# EAGLE design Generic Electronics Board (PCB B) (EAGLE 6.4)
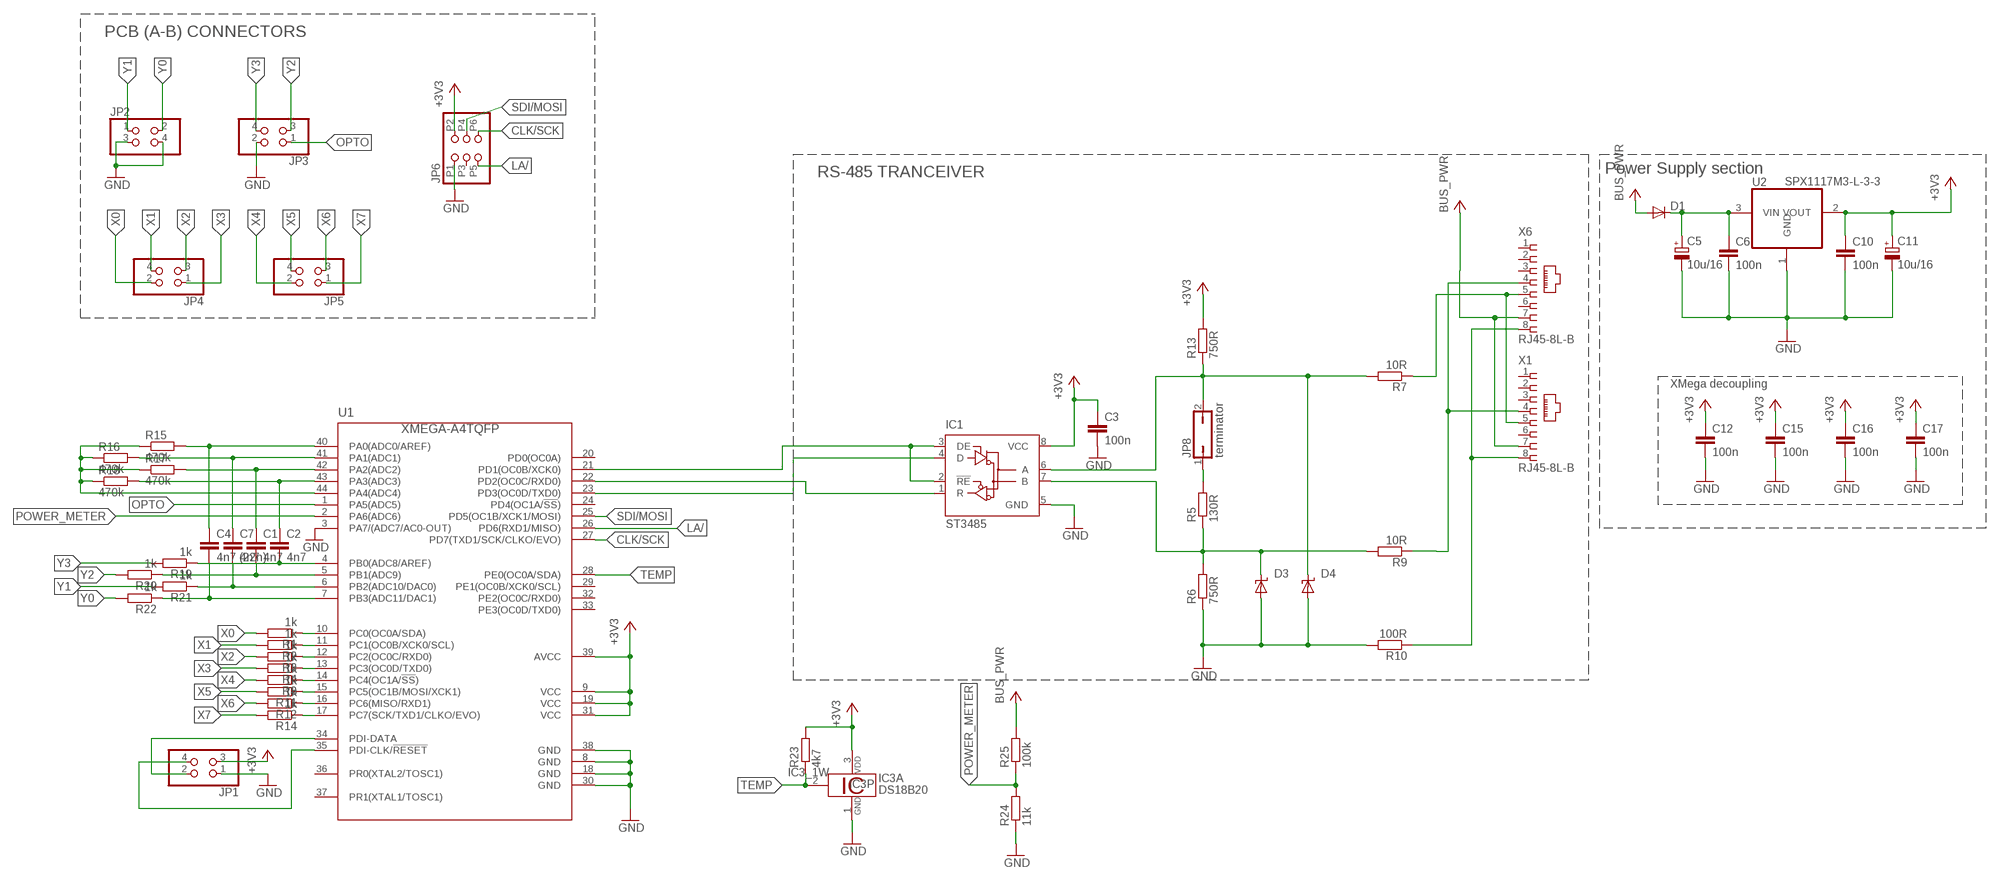
[diagram p0: schematic, sheet 1]

## Parts
C1  4n7  C-EUC0603  [C0603]
C2  4n7  C-EUC0603  [C0603]
C3  100n  C-EUC0603  [C0603]
C4  4n7 (22n)  C-EUC0603  [C0603]
C5  10u/16  CPOL-EUSMCC  [SMC_C]
C6  100n  C-EUC0603  [C0603]
C7  4n7  C-EUC0603  [C0603]
C10  100n  C-EUC0603  [C0603]
C11  10u/16  CPOL-EUSMCC  [SMC_C]
C12  100n  C-EUC0603  [C0603]
C15  100n  C-EUC0603  [C0603]
C16  100n  C-EUC0603  [C0603]
C17  100n  C-EUC0603  [C0603]
D1  DIODE-DO-214AC  [DO-214AC]
D3  SUPPRESSOR-SMBJ  [SMBJ]
D4  SUPPRESSOR-SMBJ  [SMBJ]
IC1  ST3485  75176AD  [D_R-PDSO-G8]
IC3  DS18B20  [TO92-]
JP1  PINHD-2X2SMD  [2X2SMD]
JP2  PINHD-2X2  [2X02]
JP3  PINHD-2X2  [2X02]
JP4  PINHD-2X2  [2X02]
JP5  PINHD-2X2  [2X02]
JP6  PINHD-2X3SMD  [2X3SMD]
JP8  terminator  JP1Q  [JP1]
R1  1k  R-EU_R0603  [R0603]
R2  1k  R-EU_R0603  [R0603]
R3  1k  R-EU_R0603  [R0603]
R4  1k  R-EU_R0603  [R0603]
R5  130R  R-EU_R0603  [R0603]
R6  750R  R-EU_R0603  [R0603]
R7  10R  R-EU_R0603  [R0603]
R8  1k  R-EU_R0603  [R0603]
R9  10R  R-EU_R0603  [R0603]
R10  100R  R-EU_R0603  [R0603]
R11  1k  R-EU_R0603  [R0603]
R12  1k  R-EU_R0603  [R0603]
R13  750R  R-EU_R0603  [R0603]
R14  1k  R-EU_R0603  [R0603]
R15  470k  R-EU_R0603  [R0603]
R16  470k  R-EU_R0603  [R0603]
R17  470k  R-EU_R0603  [R0603]
R18  470k  R-EU_R0603  [R0603]
R19  1k  R-EU_R0603  [R0603]
R20  1k  R-EU_R0603  [R0603]
R21  1k  R-EU_R0603  [R0603]
R22  1k  R-EU_R0603  [R0603]
R23  4k7  R-EU_R0603  [R0603]
R24  11k  R-EU_R0603  [R0603]
R25  100k  R-EU_R0603  [R0603]
U1  XMEGA-A4TQFP  [TQFP44]
U2  SPX1117M3-L-3-3  REG1117  [SOT223]
X1  RJ45-8L-B  [RJ45-NO-SHIELD]
X6  RJ45-8L-B  [RJ45-NO-SHIELD]

## Nets
+3V3: C3.1 C10.1 C11.+ C12.1 C15.1 C16.1 C17.1 IC1.8(VCC) IC3.3 JP1.3 JP6.P2 R13.2 R23.2 U1.9(VCC) U1.19(VCC) U1.31(VCC) U1.39(AVCC) U2.2(VOUT)
+12V: C5.+ C6.1 D1.C U2.3(VIN)
BUS_PWR: D1.A R25.2 X1.7 X6.7
CLK/SCK: JP6.P6 U1.27(PD7(TXD1/SCK/CLKO/EVO))
GND: C3.2 C5.- C6.2 C10.2 C11.- C12.2 C15.2 C16.2 C17.2 D3.A D4.A IC1.5(GND) IC3.1 JP1.1 JP2.3 JP2.4 JP3.2 JP6.P1 R6.1 R10.2 R24.1 U1.3(PA7/(ADC7/AC0-OUT)) U1.8(GND) U1.18(GND) U1.30(GND) U1.38(GND) U2.1(GND)
GND_RS485: R10.1 X1.8 X6.8
LA/: JP6.P5 U1.26(PD6(RXD1/MISO))
N$1: R1.1 U1.10(PC0(OC0A/SDA))
N$2: R2.1 U1.11(PC1(OC0B/XCK0/SCL))
N$4: IC1.1(R) U1.22(PD2(OC0C/RXD0))
N$5: IC1.4(D) U1.23(PD3(OC0D/TXD0))
N$6: IC1.2(!RE) IC1.3(DE) U1.21(PD1(OC0B/XCK0))
N$10: R8.1 U1.14(PC4(OC1A/!SS!))
N$11: R11.1 U1.15(PC5(OC1B/MOSI/XCK1))
N$12: R12.1 U1.16(PC6(MISO/RXD1))
N$13: R14.1 U1.17(PC7(SCK/TXD1/CLKO/EVO))
N$14: D3.C IC1.7(B) R5.1 R6.2 R9.2
N$15: JP8.1 R5.2
N$17: C2.1 R18.2 U1.43(PA3(ADC3))
N$18: C2.2 R19.1 U1.4(PB0(ADC8/AREF))
N$19: C1.2 R20.1 U1.5(PB1(ADC9))
N$20: C1.1 R17.2 U1.42(PA2(ADC2))
N$21: C7.2 R21.1 U1.6(PB2(ADC10/DAC0))
N$22: C4.2 R22.1 U1.7(PB3(ADC11/DAC1))
N$23: C7.1 R16.2 U1.41(PA1(ADC1))
N$24: C4.1 R15.2 U1.40(PA0(ADC0/AREF))
N$25: R15.1 R16.1 R17.1 R18.1 U1.44(PA4(ADC4))
OPTO: JP3.1 U1.1(PA5(ADC5))
PC2: R3.1 U1.12(PC2(OC0C/RXD0))
PC3: R4.1 U1.13(PC3(OC0D/TXD0))
PDI_CLK: JP1.4 U1.35(PDI-CLK/!RESET)
PDI_DATA: JP1.2 U1.34(PDI-DATA)
POWER_METER: R24.2 R25.1 U1.2(PA6(ADC6))
RS485_A: R7.1 X1.5 X6.5
RS485_A2: D4.C IC1.6(A) JP8.2 R7.2 R13.1
RS485_B: R9.1 X1.4 X6.4
SDI/MOSI: JP6.P4 U1.25(PD5(OC1B/XCK1/MOSI))
TEMP: IC3.2 R23.1 U1.28(PE0(OC0A/SDA))
X0: JP4.2 R1.2
X1: JP4.4 R2.2
X2: JP4.3 R3.2
X3: JP4.1 R4.2
X4: JP5.2 R8.2
X5: JP5.4 R11.2
X6: JP5.3 R12.2
X7: JP5.1 R14.2
Y0: JP2.2 R22.2
Y1: JP2.1 R21.2
Y2: JP3.3 R20.2
Y3: JP3.4 R19.2
Unconnected: JP6.P3 U1.20(PD0(OC0A)) U1.24(PD4(OC1A/!SS!)) U1.29(PE1(OC0B/XCK0/SCL)) U1.32(PE2(OC0C/RXD0)) U1.33(PE3(OC0D/TXD0)) U1.36(PR0(XTAL2/TOSC1)) U1.37(PR1(XTAL1/TOSC1)) X1.1 X1.2 X1.3 X1.6 X6.1 X6.2 X6.3 X6.6

## Notes on the sheet
- PCB (A-B) CONNECTORS
- RS-485 TRANCEIVER | Power Supply section
- XMega decoupling

## Library data of the parts
C1-C4 C6 C7 C10 C12 C15-C17 = rcl:C-EU: CAPACITOR, European symbol
C5 C11 = rcl:CPOL-EU: POLARIZED CAPACITOR, European symbol
D1 = diode:DIODE-: DIODE
D3 D4 = diode:SUPPRESSOR-: Suppressor diode
IC1 = 751xx:75176A: DIFFERENTIAL BUS TRANSCEIVER Source: http://focus.ti.com/lit/ds/symlink/sn75176a.pdf
IC3 = 1wire:DS18B20: Programmable Resolution Digital Thermometer This chip provides a onewire thermosensor with approx. 0.5°C accuracy. A programmable over/undertemperure alarm is available. The precision can be set from 9..12 bits. Notes: Vdd must be applied for accurate measurements at low temperatures, as the parasite power circuit otherwise heats the sensor. If parasite power is used, Vdd has to be connected to GND. The DS1822 is a low-cost thermometer chip, the DS18S20 is similar to the DS18B20, but with 9 Bit precision only. Author: Jan Kandziora <jjj@gmx.de>
JP1-JP5 = pinhead:PINHD-2X2: PIN HEADER
JP6 = pinhead:PINHD-2X3: PIN HEADER
JP8 = jumper:JP1Q: JUMPER
R1-R25 = rcl:R-EU_: RESISTOR, European symbol
U1 = avr-7:XMEGA-A4: Atmel XMega A4 series processor
U2 = burr-brown:REG1117: 800mA and 1A Low Dropout (LDO) Positive Regulator 1.8V, 2.5V, 2.85V, 3.3V, 5V, and Adj; MPN: REG1117; OC_FARNELL: 1097566; OC_NEWARK: 14P6981
X1 X6 = con-tycoelectronics:RJ45: CORCOM Modular RJ Jacks No Shield Source: www.tycoelectronics.com .. ENG_DS_1654001_1099_RJ_L_0507.pdf; MF: TYCO ELECTRONICS; MPN: RJ45-8L-B; OC_FARNELL: 1279843; OC_NEWARK: 52K4445

## Board
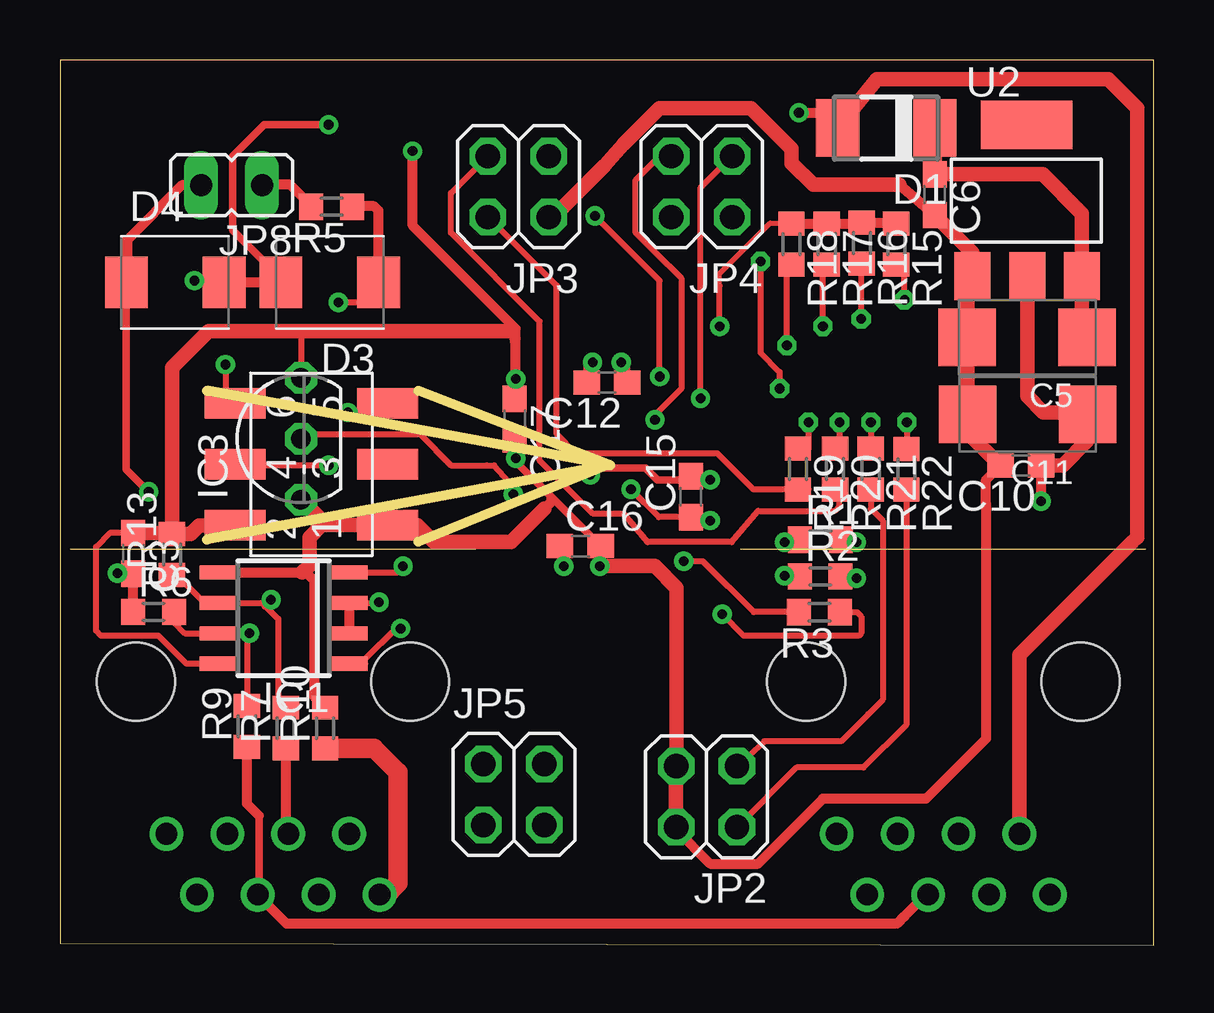
[diagram p1: board, top side]
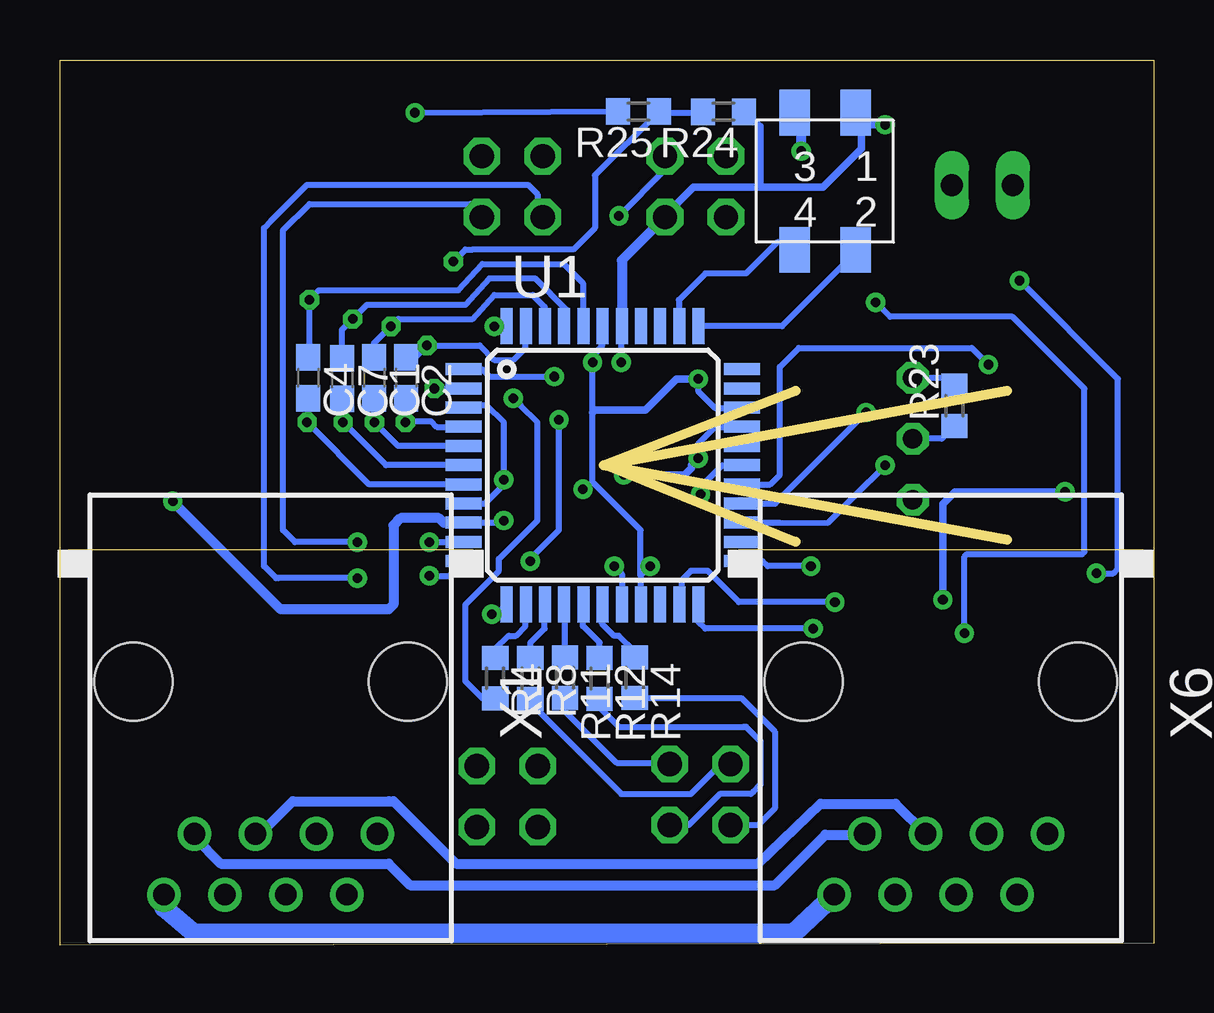
[diagram p2: board, bottom side, seen from below]

Size 45.6 x 36.9 mm. Coordinates in mm from the lower left corner, seen from the top.
Outline: 0,0.07 45.6,0 45.6,36.9 0,36.9 0,0.07
Copper layers (1*16): Top 0.035mm / dielectric 1.5mm / Bottom 0.035mm
Design rules "default": minimum track width 10mil, minimum drill 24mil, track to track 8mil, track to pad 8mil, pad to pad 8mil, via to via 8mil, smd to smd 8mil, copper to edge 40mil, drill to drill 8mil, minimum pad ring 10mil, minimum via ring 8mil, stop-mask expansion 4mil, vias tented up to drill 0mil, thermal gap 10mil
bRestrict: area 26.8,1.7 to 30,11.1; area 15.4,27.4 to 19.2,36.5
Milling: 4 lines

### Footprints (pad centres in the part's own frame; a part is rotated, then mirrored left to right if it is on the bottom)
C0603 = smd 1.1 x 1: 1 -0.85,0; 2 0.85,0
SMC_C = smd 2.4 x 2.4: + -2.5,0; - 2.5,0
DO-214AC = smd 1.8 x 2.4: A 2.025,0; C -2.025,0
SMBJ = smd 1.78 x 2.16: A 2.04,0; C -2.03,0
D_R-PDSO-G8 = smd 0.6 x 1.5: 1 -1.905,-2.75; 2 -0.635,-2.75; 3 0.635,-2.75; 4 1.905,-2.75; 5 1.905,2.75; 6 0.635,2.75; 7 -0.635,2.75; 8 -1.905,2.75
TO92- = drill 0.813 octagon: 1 -2.54,0; 2 0,0; 3 2.54,0
2X2SMD = smd 0.635 x 1.27: 1 -0.635,-2.54; 2 -0.635,2.54; 3 1.905,-2.54; 4 1.905,2.54; P$1 0,2.54; P$2 2.54,2.54; P$4 0,-2.54; P$5 2.54,-2.54; P$9 2.54,3.175; P$10 1.905,3.175; P$11 0,3.175; P$12 -0.635,3.175; P$13 -0.635,-3.175; P$14 0,-3.175; P$15 1.905,-3.175; P$16 2.54,-3.175
2X02 = drill 1.016 octagon: 1 -1.27,-1.27; 2 -1.27,1.27; 3 1.27,-1.27; 4 1.27,1.27
2X3SMD = smd 1.27 x 2.54: P1 -3.175,-3.175; P2 -3.175,3.175; P3 -0.635,-3.175; P4 -0.635,3.175; P5 1.905,-3.175; P6 1.905,3.175
JP1 = drill 0.914 long: 1 0,-1.27; 2 0,1.27
R0603 = smd 1 x 1.1: 1 -0.85,0; 2 0.85,0
TQFP44 = smd 1.5 x 0.5: 1 -5.8,4; 2 -5.8,3.2; 3 -5.8,2.4; 4 -5.8,1.6; 5 -5.8,0.8; 6 -5.8,0; 7 -5.8,-0.8; 8 -5.8,-1.6; 9 -5.8,-2.4; 10 -5.8,-3.2; 11 -5.8,-4; 23 5.8,-4; 24 5.8,-3.2; 25 5.8,-2.4; 26 5.8,-1.6; 27 5.8,-0.8; 28 5.8,0; 29 5.8,0.8; 30 5.8,1.6; 31 5.8,2.4; 32 5.8,3.2; 33 5.8,4 | smd 0.5 x 1.5: 12 -4,-5.8; 13 -3.2,-5.8; 14 -2.4,-5.8; 15 -1.6,-5.8; 16 -0.8,-5.8; 17 0,-5.8; 18 0.8,-5.8; 19 1.6,-5.8; 20 2.4,-5.8; 21 3.2,-5.8; 22 4,-5.8; 34 4,5.8; 35 3.2,5.8; 36 2.4,5.8; 37 1.6,5.8; 38 0.8,5.8; 39 0,5.8; 40 -0.8,5.8; 41 -1.6,5.8; 42 -2.4,5.8; 43 -3.2,5.8; 44 -4,5.8
SOT223 = smd 1.499 x 2.007: 1 -2.261,-3.15; 2 0.025,-3.15; 3 2.311,-3.15 | smd 3.81 x 2.007: 4 0,3.15
RJ45-NO-SHIELD = drill 0.9 pad 1.4: 1 -4.445,6.35; 2 -3.175,8.89; 3 -1.905,6.35; 4 -0.635,8.89; 5 0.635,6.35; 6 1.905,8.89; 7 3.175,6.35; 8 4.445,8.89 | hole 3.251: -5.715,0; 5.715,0

### Placement (x,y rotation side)
C1  32.51,23.65 270 bottom
C2  31.17,23.65 270 bottom
C3  3.06,16.33 270 top
C4  35.26,23.65 270 bottom
C5  40.32,25.34 180 top
C6  36.46,31.28 270 top
C7  33.84,23.62 270 bottom
C10  40.05,20 180 top
C11  40.33,22.13 180 top
C12  22.8,23.46 180 top
C15  26.3,18.69 90 top
C16  21.69,16.63 0 top
C17  18.95,21.93 270 top
D1  34.44,34.06 180 top
D3  11.25,27.63 180 top
D4  4.8,27.63 0 top
IC1  9.32,13.63 90 top
IC3  10.05,21.11 90 top
JP1  12.76,31.84 180 bottom
JP2  26.95,6.19 180 top
JP3  19.11,31.62 180 top
JP4  26.75,31.62 180 top
JP5  18.92,6.28 0 top
JP6  10.48,20.68 90 top
JP8  7.15,31.68 90 top
R1  31.7,16.9 0 top
R2  31.69,15.37 0 top
R3  31.66,13.88 180 top
R4  27.46,11.13 270 bottom
R5  11.32,30.78 180 top
R6  3.9,13.89 0 top
R7  9.41,9.05 90 top
R8  25.99,11.12 270 bottom
R9  7.79,9.12 90 top
R10  11.05,9.05 90 top
R11  24.55,11.15 270 bottom
R12  23.11,11.12 270 bottom
R13  4.67,16.29 90 top
R14  21.64,11.15 270 bottom
R15  34.86,29.22 270 top
R16  33.42,29.26 270 top
R17  31.96,29.22 270 top
R18  30.49,29.22 270 top
R19  30.76,19.85 270 top
R20  32.31,19.85 270 top
R21  33.79,19.85 270 top
R22  35.28,19.84 270 top
R23  8.32,22.48 90 bottom
R24  17.94,34.74 180 bottom
R25  21.49,34.75 180 bottom
U1  22.98,20.01 0 bottom
U2  40.29,31.04 0 top
X1  36.82,10.99 180 bottom
X6  8.88,10.99 180 bottom

### Tracks (layer width: path | path; a pad name or v marks a point on that pad's centre or on a via)
+3V3  (via drill 0.4)
  Top 0.254: C12.1 23.65,24.05 v23.4,24.3 | C16.1 20.84,15.96 v21,15.8 | v27.1,17.7 26.44,17.7 C15.1 24.96,17.84 v23.8,19 | C17.1 18.95,23.55 v19,23.6 | 18.8,25.6 18.9,24.9 | 18.8,25.6 18.6,25.6 18.8,25.6 | 18.8,25.6 19,25.3 | IC1.8 5.27,11.73 4.2,12.8 4.1,12.9 1.7,12.9 1.5,13.1 1.5,16.6 2.1,17.2 3.04,17.2 C3.1 | 6.2,25.6 10.1,25.6 10.05,25.55 IC3.3
  Top 0.406: v40.9,18.5 C10.1 | v19,23.6 19,25.3 19,25.7 14.7,30 v14.7,33.1
  Top 0.61: U2.2 40.32,22.88 41,22.2 42.76,22.2 C11.+ 42.83,21.03 41.8,20 C10.1 | C3.1 4.63,17.18 R13.2 | R13.2 5.44,17.14 5.8,17.5 JP6.P2 | R13.2 4.67,24.07 6.2,25.6 10.1,25.6 18.6,25.6 18.8,25.6
  Bottom 0.254: U1.39 23,25.79 23,25 23.4,24.5 v23.4,24.3 23.4,22.2 23.4,19.3 | v21,15.8 21.4,15.4 | 21.4,15.4 21.4,14.1 21.38,14.12 U1.19 | v27.1,17.7 27.2,17.6 28.8,17.6 | 21.4,15.4 21.4,17.3 23.4,19.3 | v23.8,19 23.7,19 23.4,19.3 | v19,23.6 19,23.1 18.3,22.4 17.2,22.4 U1.31 | R23.2 8.64,23.65 IC3.3
  Bottom 0.305: v19,23.6 19.9,23.6 21.2,22.3 23.3,22.3 23.4,22.2
  Bottom 0.406: v40.9,18.5 36.4,14 31.9,14 31.7,14.2 31.7,17.5 31.4,17.8 29.8,17.8 29.6,17.6 28.8,17.6 U1.9 | v14.7,33.1 14.7,33.98 | 14.7,33.98 14.7,34.4 | 14.7,34.4 14.7,34.5 14.7,34.4 | JP1.3 14.66,34.02 14.7,33.98
+12V
  Top 0.61: D1.C 36.46,34.45 C6.1 40.97,32.13 42.6,30.5 42.6,28.09 U2.3 42.6,25.56 C5.+
BUS_PWR  (via drill 0.4)
  Top 0.406: v30.8,34.7 32.41,34.7 D1.A
  Top 0.61: X1.7 39.99,12.09 44.7,16.8 44.9,17 44.9,34.9 43.7,36.1 34.05,36.1 D1.A
  Bottom 0.254: R25.2 v30.8,34.69
  Bottom 0.406: X1.7 39.99,4.5 38.9,3.4 31.9,3.4 31,2.5 15.8,2.5 13.7,4.6 12.09,4.6 X6.7 | v30.8,34.69 v30.8,34.7
CLK/SCK  (via drill 0.4)
  Top 0.254: JP6.P6 7.32,22.7 7.4,22.7 7.4,22.6 6.9,23.1 v6.9,24.2
  Bottom 0.254: U1.27 15.99,19.21 15.6,19.6 15.6,24.1 14.8,24.9 7.6,24.9 7.1,24.4 v6.9,24.2
GND  (via drill 0.4)
  Top 0.254: C12.2 21.95,24.15 v22.2,24.3 | C16.2 22.5,16.59 v22.5,15.8 | C15.2 26.44,19.4 v27.1,19.4 | C17.2 18.95,20.35 v19,20.3 | 10.1,15.54 10.27,15.54 | 20.4,18.4 20.4,18.7 20.43,18.73 | C3.2 2.53,15.47 v2.4,15.5 | v5.6,27.7 6.77,27.7 D4.A | 10.91,17.72 10.91,17.51
  Top 0.305: v19,20.3 19,20.17 20.43,18.73 C16.2 | 26.44,19.4 24.9,19.4 24.4,19.9 22.4,19.9 v22.1,19.6 | D3.A 9.21,27.79 7.2,29.8 7.2,32.9 8.5,34.2 v11.2,34.2
  Top 0.406: JP2.4 25.7,4.9 25.7,4.8 27.1,3.4 29.1,3.4 29.9,4.2 31.8,6.1 36.1,6.1 36.5,6.5 38.6,8.6 38.6,18.4 38.6,19.4 C10.2 | D4.A D3.A | 34.99,31.7 C6.2 | R6.1 C3.2 | IC1.5 10.1,15.54 | 10.27,15.54 10.6,15.2 10.6,10.35 R10.2 | 20.2,18.2 20.4,18.4 20.5,18.5
  Top 0.61: C10.2 37.83,21.37 C11.- C5.- 37.82,27.88 U2.1 38.03,28.86 C6.2 | JP2.4 25.68,7.31 | 25.68,7.31 JP2.3 | JP2.3 25.68,7.48 25.7,7.5 25.7,14.9 24.8,15.8 v22.5,15.8 | JP2.3 25.68,7.31 | JP3.2 20.55,30.35 22.7,32.5 23.5,33.4 25,34.9 28.8,34.9 30.5,33.2 30.5,32.6 31.4,31.7 34.99,31.7 | 20.2,18.2 18.8,16.8 15.6,16.8 14.89,17.51 JP6.P1 10.91,17.51 10.4,17 10.4,15.84 10.1,15.54 | IC3.1 10.91,17.72
  Bottom 0.254: v22.2,24.3 22.2,25.79 U1.38 | v22.5,15.8 22.18,15.48 U1.18 | 28.8,18.4 27.9,18.4 27.1,19.2 v27.1,19.4 27.1,21.8 27.8,22.5 28.69,22.5 U1.3 | v19,20.3 19,20.9 18.3,21.6 U1.30 | v2.4,15.5 1.7,15.5 1.5,15.7 1.5,23.6 v5.6,27.7 | R24.1 16.4,34.15 16.4,31.6
  Bottom 0.305: v22.1,19.6 19.57,19.6 19.29,19.88 19.29,20.02 v19,20.3 | v11.2,34.2 11.95,34.2 JP1.1 12.2,34.45 12.2,34.5 | JP3.2 20.38,30.42 19.3,31.5 19.2,31.6 16.4,31.6 13.8,31.6 12.2,33.2 12.2,34.5 | 12.2,34.5 12.3,34.5 12.82,33.98
  Bottom 0.406: 28.8,18.4 U1.8 | JP3.2 22.18,28.55 U1.38
GND_RS485
  Top 0.254: 13.5,2 13.42,2 X6.8
  Top 0.813: R10.1 13.1,8.2 14.1,7.2 14.1,2.6 13.5,2
  Bottom 0.813: X1.8 41.26,1.57 40,0.5 15.02,0.5 X6.8
LA/  (via drill 0.4)
  Top 0.254: v12,22.2 13.27,22.2 JP6.P5
  Bottom 0.254: U1.26 15.79,18.41 v12,22.2
N$1  (via drill 0.4)
  Top 0.254: R1.1 v30.2,16.8
  Bottom 0.254: v30.2,16.8 U1.10
N$2  (via drill 0.4)
  Top 0.254: R2.1 30.23,15.37 v30.2,15.4
  Bottom 0.254: v30.2,15.4 29.39,15.4 U1.11
N$4  (via drill 0.4)
  Top 0.254: IC1.1 12.73,11.73 12.73,11.93 14,13.2 v14.2,13.2
  Bottom 0.254: v14.2,13.2 18.7,13.2 19,13.5 19,14.19 U1.22
N$5  (via drill 0.4)
  Top 0.254: IC1.4 14.03,15.54 v14.3,15.8
  Bottom 0.254: v14.3,15.8 16.1,15.8 16.3,16 U1.23
N$6  (via drill 0.4)
  Top 0.254: IC1.3 13.27,14.27 v13.3,14.3
  Top 0.406: IC1.2 IC1.3
  Bottom 0.254: v13.3,14.3 17.3,14.3 18.6,15.6 19.3,15.6 19.7,15.2 19.7,14.3 19.8,14.2 U1.21
N$10
  Bottom 0.254: R8.1 25.99,12.61 25.4,13.2 25.4,14.19 U1.14
N$11
  Bottom 0.254: R11.1 24.55,14.18 U1.15
N$12
  Bottom 0.254: R12.1 23.11,12.61 23.8,13.3 23.8,14.19 U1.16
N$13
  Bottom 0.254: R14.1 21.64,12.24 22.3,12.9 22.5,12.9 23,13.4 23,14.3 23,14.23 U1.17
N$14  (via drill 0.4)
  Top 0.254: R6.2 4.75,13.45 5.2,13 IC1.7 | IC1.7 7.5,13 7.8,12.7 R9.2 | IC1.7 7.7,13 v7.9,13 | v11.6,26.8 12.5,26.8 13.3,27.6 D3.C
  Top 0.406: D3.C 13.28,30.62 13.1,30.8 12.19,30.8 R5.1
  Bottom 0.254: v7.9,13 7.9,16.2 7.8,16.3 3,16.3 2.9,16.4 2.9,23.2 5.9,26.2 11,26.2 v11.6,26.8
N$15
  Top 0.406: R5.2 10.47,30.83 9.6,31.7 8.44,31.7 JP8.1
N$17  (via drill 0.4)
  Top 0.254: v30.3,25 30.3,28.56 R18.2
  Bottom 0.254: C2.1 30.8,24.5 v30.3,25 28.1,25 27.5,24.4 26.7,24.4 26.2,24.9 26.2,25.79 U1.43
N$18  (via drill 0.4)
  Top 0.254: v31.2,21.8 31.2,20.7 R19.1
  Bottom 0.254: C2.2 31.16,21.84 | 31.16,21.84 v31.2,21.8 | 31.16,21.84 30.14,21.84 29.9,21.6 U1.4
N$19  (via drill 0.4)
  Top 0.254: v32.5,21.8 32.5,20.71 R20.1
  Bottom 0.254: C1.2 v32.51,21.81 v32.5,21.8 31.51,20.81 U1.5
N$20  (via drill 0.4)
  Top 0.254: v31.8,25.8 31.8,28.53 R17.2
  Bottom 0.254: C1.1 32.51,25.09 v31.8,25.8 31.5,26.1 28.4,26.1 27.5,27.1 25.9,27.1 25.4,26.6 25.4,25.83 U1.42
N$21  (via drill 0.4)
  Top 0.254: v33.8,21.8 R21.1
  Bottom 0.254: C7.2 33.84,21.84 v33.8,21.8 32.01,20.01 U1.6
N$22  (via drill 0.4)
  Top 0.254: v35.3,21.8 35.3,20.71 R22.1
  Bottom 0.254: C4.2 35.26,21.84 v35.3,21.8 32.71,19.21 U1.7
N$23  (via drill 0.4)
  Top 0.254: v33.4,26.1 33.4,28.43 R16.2
  Bottom 0.254: C7.1 33.84,25.66 v33.4,26.1 32.8,26.7 28.7,26.7 27.7,27.8 25.8,27.8 24.5,26.5 24.5,25.89 U1.41
N$24  (via drill 0.4)
  Top 0.254: v35.2,26.9 35.2,28.23 R15.2
  Bottom 0.254: C4.1 35.2,24.5 v35.2,26.9 34.8,27.3 29,27.3 28,28.4 24.6,28.4 23.8,27.6 23.8,25.83 U1.40
N$25  (via drill 0.4)
  Top 0.203: 27.5,27.48 27.5,28 29.6,30.1 30.22,30.1 R18.1
  Top 0.254: v27.5,25.8 27.5,27.48
  Top 0.406: R18.1 31.93,30.07 | 31.93,30.07 32,30 | R15.1 34.82,30.11 R16.1 33.38,30.07 R17.1 31.93,30.07
  Bottom 0.254: U1.44 v27.49,25.81 v27.5,25.8
OPTO  (via drill 0.4)
  Top 0.254: v25,23.7 25,27.7 v22.3,30.4
  Bottom 0.254: U1.1 28.01,24.01 27.7,23.7 v25,23.7 | v22.3,30.4 20.4,32.3 20.4,32.8 20.38,32.82 JP3.1
PC2  (via drill 0.4)
  Top 0.254: R3.1 33.22,13.88 33.4,13.7 33.4,13 33.3,12.9 28.5,12.9 v27.6,13.8
  Bottom 0.254: v27.6,13.8 27.39,13.8 U1.12
PC3
  Bottom 0.254: R4.1 27.46,12.34 26.9,12.9 26.6,12.9 26.2,13.3 26.2,14.2 U1.13
PDI_CLK
  Bottom 0.254: JP1.4 15.7,29.3 17,28 18.7,28 19.8,26.9 19.8,25.83 U1.35
PDI_DATA
  Bottom 0.254: JP1.2 12.12,29.18 15.5,25.8 U1.34
POWER_METER  (via drill 0.4)
  Top 0.254: v29.2,28.5 29.2,24.7 30,23.9 v30,23.2
  Bottom 0.254: R24.2 18.8,34.8 18.8,34.7 20.59,34.7 R25.1 23.3,32.09 23.3,29.9 24.2,29 24.3,29 24.4,29 28.4,29 28.7,29 v29.2,28.5 | v30,23.2 29.6,23.2 29.5,23.2 28.8,23.2 U1.2
RS485_A
  Top 0.406: R7.1 9.41,4.75 X6.5
  Bottom 0.406: X1.5 37.26,4.64 35.9,6 31.9,6 31.7,6 29.1,3.4 16.5,3.4 13.9,5.9 10.77,5.9 X6.5
RS485_A2  (via drill 0.4)
  Top 0.254: R7.2 9.1,10.21 9.1,13.6 8.55,14.15 8.43,14.27 IC1.6 6.03,14.27 5.2,15.1 5.01,15.1 R13.1
  Top 0.305: D4.C 2.77,19.83 v3.7,18.9 | v8.8,14.4 8.55,14.15
  Top 0.406: JP8.2 5.08,31.68 2.8,29.4 2.8,27.66 D4.C
  Bottom 0.305: v3.7,18.9 8.3,18.9 8.8,18.4 v8.8,14.4
RS485_B
  Top 0.305: 8.3,5.4 8.3,2.16 X6.4 | X1.4 36.1,2.1
  Top 0.406: 36.1,2.1 35.2,1.2 34.9,0.9 9.45,0.9 X6.4 | R9.1 7.79,5.91 8.3,5.4
SDI/MOSI  (via drill 0.4)
  Top 0.254: 7.35,20 JP6.P4 7.35,20 | v11.2,20 7.35,20
  Bottom 0.254: U1.25 15.59,17.61 13.6,17.6 12.5,18.7 v11.2,20
TEMP  (via drill 0.4)
  Top 0.254: IC3.2 10.24,21.3 15,21.3 16.3,20 17.8,20 18.1,20 18.9,19.1 v18.9,18.8
  Bottom 0.254: R23.1 8.84,21.11 IC3.2 | U1.28 17.2,20 18,20 18.9,19.1 v18.9,18.8
X0  (via drill 0.4)
  Top 0.254: R1.2 v33.2,16.8
  Bottom 0.254: v33.2,16.8 35.8,16.8 36.3,17.3 36.3,29.8 35.2,30.9 28.5,30.9 28,30.4 | 28,30.4 28.1,30.4 | 28.1,30.4 28,30.4 | 28,30.4 28.1,30.4 | 28.1,30.4 28.07,30.4 JP4.2
X1  (via drill 0.4)
  Top 0.254: R2.2 v33.2,15.3
  Bottom 0.254: v33.2,15.3 36.5,15.3 36.6,15.3 37.1,15.8 37.1,16.1 | JP4.4 25.7,30.57 25.7,31.3 26.1,31.7 35.3,31.7 36.8,30.2 37.1,29.9 37.1,16.1 | 37.1,16 37.1,16.1
X2  (via drill 0.4)
  Top 0.254: R3.2 28.92,13.88 26.8,16 v26,16 | JP4.3 25.5,32.9 25,32.9 24,31.9 24,29.7 24.8,28.9 25.9,27.8 25.9,23.2 24.8,22.1 v24.8,21.9
  Bottom 0.254: v26,16 26,16.1 24.8,17.3 v24.8,21.9
X3  (via drill 0.4)
  Top 0.254: v26.7,22.8 26.7,31.57 JP4.1
  Bottom 0.254: R4.2 27.98,10.28 28.7,11 28.7,14.2 27.3,15.6 27.3,16.1 25.7,17.7 25.7,21.8 26.4,22.5 26.6,22.7 v26.7,22.8
X4
  Bottom 0.254: R8.2 25.99,10.09 22.2,6.3 19.3,6.3 18.2,7.4 18.1,7.5 17.7,7.5 JP5.2
X5
  Bottom 0.254: R11.2 24.55,9.75 22.4,7.6 20.24,7.6 JP5.4
X6
  Bottom 0.254: R12.2 23.11,9.91 22.3,9.1 17.1,9.1 17,9.1 16.4,8.5 16.4,6.7 16.7,6.4 16.8,6.3 18.1,6.3 19.4,5 JP5.3
X7
  Bottom 0.254: R14.2 17.4,10.3 17.2,10.3 15.8,8.9 15.8,5.7 16.5,5 JP5.1
Y0
  Top 0.254: R22.2 35.28,9.18 33.5,7.4 30.7,7.4 JP2.2
Y1
  Top 0.254: R21.2 33.8,19.1 R21.2 | JP2.1 29.36,8.5 32.57,8.5 33.69,9.62 34.3,10.23 34.3,17.7 33.8,18.2 R21.2 | R21.2
Y2
  Top 0.254: JP3.3 16.3,31.35 16.3,29.7 20,26 20,20.2 22.2,18 23.5,18 24.5,16.8 28,16.8 29.1,18.1 32.3,18.1 32.5,18.3 32.5,18.99 R20.2
Y3
  Top 0.254: R19.2 31.2,19 R19.2 | R19.2 30,19 29.6,19 28.9,19 27.4,20.5 21.5,20.5 20.7,21.3 20.7,27.5 17.7,30.5 17.7,30.49 JP3.4

### Text on the board
Reference: Generic Electronics Board (PCB B) | ver. 1.00